# Altium schematic sheet RGMII_PHY.SchDoc
size A4; Date: 07.08.2025; CheckedBy: Own Check; CompanyName: No Company; DocumentNumber: ELK.PCB.0005.0005.A.A; Revision: V0.0.1; SheetNumber: 17; SheetTotal: 22
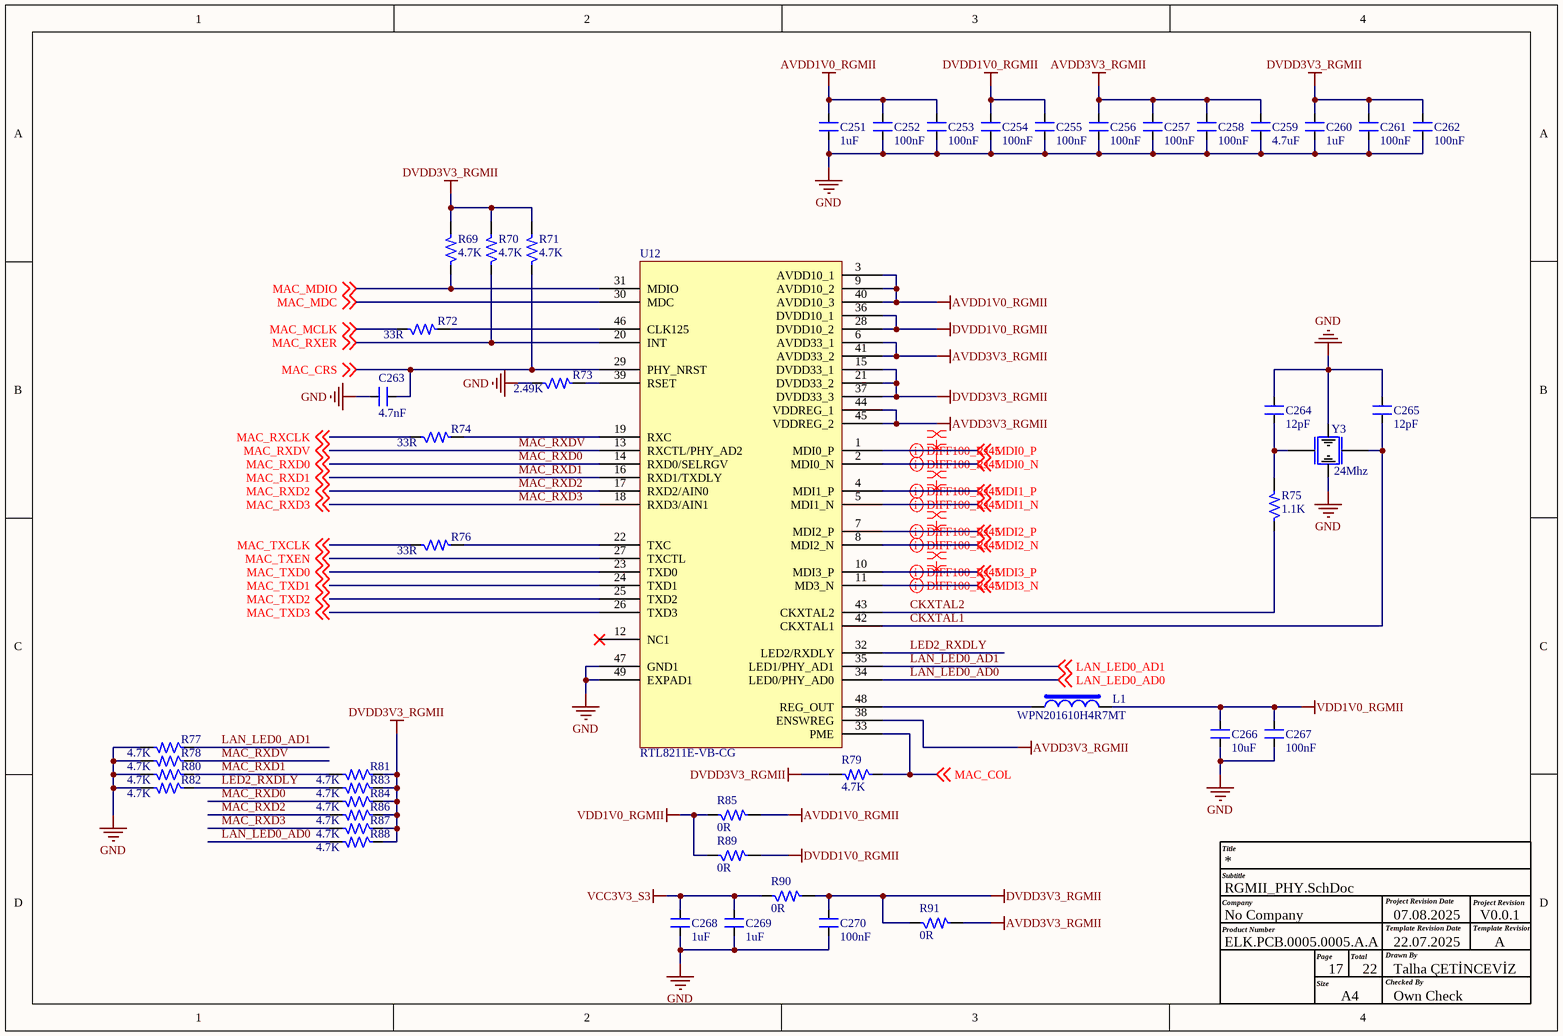
[diagram p0: RGMII_PHY.SchDoc]

## Parts
C251  1uF  [CAP_0201]
C252  100nF  [CAP_0201]
C253  100nF  [CAP_0201]
C254  100nF  [CAP_0201]
C255  100nF  [CAP_0201]
C256  100nF  [CAP_0201]
C257  100nF  [CAP_0201]
C258  100nF  [CAP_0201]
C259  4.7uF  [CAP_0201]
C260  1uF  [CAP_0201]
C261  100nF  [CAP_0201]
C262  100nF  [CAP_0201]
C263  4.7nF  [CAP_0201]
C264  12pF  [CAP_0201]
C265  12pF  [CAP_0201]
C266  10uF  [CAP_0402]
C267  100nF  [CAP_0201]
C268  1uF  [CAP_0201]
C269  1uF  [CAP_0201]
C270  100nF  [CAP_0201]
L1  WPN201610H4R7MT  [IND_62.9_110X86.6_SMD]
R69  4.7K  [RES_0201]
R70  4.7K  [RES_0201]
R71  4.7K  [RES_0201]
R72  33R  [RES_0201]
R73  2.49K  [RES_0201]
R74  33R  [RES_0201]
R75  1.1K  [RES_0201]
R76  33R  [RES_0201]
R77  4.7K  [RES_0201]
R78  4.7K  [RES_0201]
R79  4.7K  [RES_0201]
R80  4.7K  [RES_0201]
R81  4.7K  [RES_0201]
R82  4.7K  [RES_0201]
R83  4.7K  [RES_0201]
R84  4.7K  [RES_0201]
R85  0R  [RES_0201]
R86  4.7K  [RES_0201]
R87  4.7K  [RES_0201]
R88  4.7K  [RES_0201]
R89  0R  [RES_0201]
R90  0R  [RES_0201]
R91  0R  [RES_0201]
U12  RTL8211E-VB-CG  [QFN48_19.6_324X324_SMD]
Y3  24Mhz  [XTAL_ABM8AIG-24.000MHZ-12-2Z-T3]

## Nets
AVDD1V0_RGMII: C251.2 C252.2 C253.2 R85.2 U12.3(AVDD10_1) U12.9(AVDD10_2) U12.40(AVDD10_3)
AVDD3V3_RGMII: C256.2 C257.2 C258.2 C259.2 R91.2 U12.6(AVDD33_1) U12.38(ENSWREG) U12.41(AVDD33_2) U12.44(VDDREG_1) U12.45(VDDREG_2)
DVDD1V0_RGMII: C254.2 C255.2 R89.2 U12.28(DVDD10_2) U12.36(DVDD10_1)
DVDD3V3_RGMII: C260.2 C261.2 C262.2 C270.2 R69.2 R70.2 R71.2 R79.2 R81.1 R83.1 R84.1 R86.1 R87.1 R88.1 R90.2 R91.1 U12.15(DVDD33_1) U12.21(DVDD33_2) U12.37(DVDD33_3)
GND: C251.1 C252.1 C253.1 C254.1 C255.1 C256.1 C257.1 C258.1 C259.1 C260.1 C261.1 C262.1 C263.2 C264.1 C265.1 C266.1 C267.1 C268.1 C269.1 C270.1 R73.1 R77.2 R78.2 R80.2 R82.2 U12.47(GND1) U12.49(EXPAD1) Y3.2 Y3.4
VCC3V3_S3: C268.2 C269.2 R90.1
VDD1V0_RGMII: C266.2 C267.2 L1.2 R85.1 R89.1
CKXTAL1: C265.2 U12.42(CKXTAL1) Y3.1
CKXTAL2: R75.1 U12.43(CKXTAL2)
LAN_LED0_AD0: R88.2 U12.34(LED0/PHY_AD0) ; off-sheet LAN_LED0_AD0
LAN_LED0_AD1: R77.1 U12.35(LED1/PHY_AD1) ; off-sheet LAN_LED0_AD1
LED2_RXDLY: R82.1 R83.2 U12.32(LED2/RXDLY)
MAC_COL: R79.1 U12.33(PME) ; off-sheet MAC_COL
MAC_CRS: C263.1 R71.1 U12.29(PHY_NRST) ; off-sheet MAC_CRS
MAC_MCLK: R72.1 ; off-sheet MAC_MCLK
MAC_MDC: U12.30(MDC) ; off-sheet MAC_MDC
MAC_MDIO: R69.1 U12.31(MDIO) ; off-sheet MAC_MDIO
MAC_RXCLK: R74.1 ; off-sheet MAC_RXCLK
MAC_RXD0: R84.2 U12.14(RXD0/SELRGV) ; off-sheet MAC_RXD0
MAC_RXD1: R80.1 R81.2 U12.16(RXD1/TXDLY) ; off-sheet MAC_RXD1
MAC_RXD2: R86.2 U12.17(RXD2/AIN0) ; off-sheet MAC_RXD2
MAC_RXD3: R87.2 U12.18(RXD3/AIN1) ; off-sheet MAC_RXD3
MAC_RXDV: R78.1 U12.13(RXCTL/PHY_AD2) ; off-sheet MAC_RXDV
MAC_RXER: R70.1 U12.20(INT) ; off-sheet MAC_RXER
MAC_TXCLK: R76.1 ; off-sheet MAC_TXCLK
MAC_TXD0: U12.23(TXD0) ; off-sheet MAC_TXD0
MAC_TXD1: U12.24(TXD1) ; off-sheet MAC_TXD1
MAC_TXD2: U12.25(TXD2) ; off-sheet MAC_TXD2
MAC_TXD3: U12.26(TXD3) ; off-sheet MAC_TXD3
MAC_TXEN: U12.27(TXCTL) ; off-sheet MAC_TXEN
MDI0_N: U12.2(MDI0_N) ; off-sheet MDI0_N
MDI0_P: U12.1(MDI0_P) ; off-sheet MDI0_P
MDI1_N: U12.5(MDI1_N) ; off-sheet MDI1_N
MDI1_P: U12.4(MDI1_P) ; off-sheet MDI1_P
MDI2_N: U12.8(MDI2_N) ; off-sheet MDI2_N
MDI2_P: U12.7(MDI2_P) ; off-sheet MDI2_P
MDI3_N: U12.11(MD3_N) ; off-sheet MDI3_N
MDI3_P: U12.10(MDI3_P) ; off-sheet MDI3_P
NetC264_2: C264.2 R75.2 Y3.3
NetL1_1: L1.1 U12.48(REG_OUT)
NetR72_2: R72.2 U12.46(CLK125)
NetR73_2: R73.2 U12.39(RSET)
NetR74_2: R74.2 U12.19(RXC)
NetR76_2: R76.2 U12.22(TXC)

Not connected (* = marked no-connect by the designer): U12 12(NC1)*

## Layout directives
differential pair; differential pair class DIFF100_RJ45: MDI0_N, MDI0_P, MDI1_N, MDI1_P, MDI2_N, MDI2_P, MDI3_N, MDI3_P
net class LAN SIG. GROUP; net class DIFF_PAIR_CLASS: MDI0_N, MDI0_P, MDI1_N, MDI1_P, MDI2_N, MDI2_P, MDI3_N, MDI3_P

## Notes on the sheet
- Title
- Company
- Product Number
- Subtitle
- Project Revision Date
- Template Revision Date
- Project Revision
- Template Revision
- Size
- Page
- A4
- Total
- Checked By
- Drawn By
- 22.07.2025
- Talha ÇETİNCEVİZ
- A

## Library data of the parts
C251 C260 C268 C269 = CAP_1uF-16V-10%-0201: 1µF ±20% 16V Ceramic Capacitor X5R 0201 (0603 Metric); Manufacturer: Samsung Electro-Mechanics; Manufacturer Part Number: CL03A105MO3NRNH; Case/Package: 0201; Supplier-1: Digikey
C252-C258 C261 C262 C267 C270 = CAP_100nF-25V-10%-0201: 0.1µF ±10% 25V Ceramic Capacitor X5R 0201 (0603 Metric); Manufacturer: TDK Corporation; Manufacturer Part Number: C0603X5R1E104K030BB; Case/Package: 0201; Supplier-1: Digikey
C259 = CAP_4.7uF-6.3V-20%-0201: 4.7µF ±20% 6.3V Ceramic Capacitor X5R 0201 (0603 Metric); Manufacturer: Murata Electronics; Manufacturer Part Number: GRM035R60J475ME15D; Case/Package: 0201; Supplier-1: Digikey
C263 = CAP_4.7nF-10V-10%-0201: 4700pF ±10% 10V Ceramic Capacitor X7R 0201 (0603 Metric); Manufacturer: AVX Corporation; Manufacturer Part Number: 0201ZC472KAT2A; Case/Package: 0201; Supplier-1: Digikey
C264 C265 = CAP_12pF-16V-10%-0201: 12pF ±10% 16V Ceramic Capacitor C0G, NP0 0201 (0603 Metric); Manufacturer: AVX Corporation; Manufacturer Part Number: 0201YA120KAT2A; Case/Package: 0201; Supplier-1: Digikey
C266 = CAP_10uF-10V-20%-0402: 10µF ±20% 10V Ceramic Capacitor X5R 0402 (1005 Metric); Manufacturer Part Number: CL05A106MP5NUNC; Manufacturer: Samsung Electro-Mechanics; Case/Package: 0402; Supplier-1: Digikey
L1 = IND_4.7uH-0.9A-20%-SMD: 4.7uH ±20% 900mA 425mΩ SMD,2.0x1.6x1.0mm Power Inductors RoHS; Manufacturer: Sunlord; Manufacturer Part Number: WPN201610H4R7MT; Case/Package: SMD; Supplier-1: LCSC
R69-R71 R77-R84 R86-R88 = RES_4.7K-0.1W-1%-0201: 4.02 kOhms ±1% 0.05W, 1/20W Chip Resistor 0201 (0603 Metric) Thick Film; Manufacturer: Yageo; Manufacturer Part Number: RC0201FR-074K02L; Case/Package: 0201; Supplier-1: Digikey
R72 R74 R76 = RES_33R-0.05W-1%-0201: 33 Ohms ±1% 0.05W, 1/20W Chip Resistor 0201 (0603 Metric) Thick Film; Manufacturer: Yageo; Manufacturer Part Number: RC0201FR-0733RL; Case/Package: 0201; Supplier-1: Digikey
R73 = RES_2.49K-0.05W-1%-0201: 2.49 kOhms ±1% 0.05W, 1/20W Chip Resistor 0201 (0603 Metric) Automotive AEC-Q200 Thick Film; Manufacturer: Panasonic Electronic Components; Manufacturer Part Number: ERJ-1GNF2491C; Case/Package: 0201; Supplier-1: Digikey
R75 = RES_1.1K-0.05W-1%-0201: 1.1 kOhms ±1% 0.05W, 1/20W Chip Resistor 0201 (0603 Metric) Automotive AEC-Q200 Thick Film; Manufacturer: Panasonic Electronic Components; Manufacturer Part Number: ERJ-1GNF1101C; Case/Package: 0201; Supplier-1: Digikey
R85 R89-R91 = RES_0R-0.05W-1%-0201: 0 Ohms Jumper 0.05W, 1/20W Chip Resistor 0201 (0603 Metric) Automotive AEC-Q200 Thick Film; Manufacturer: Bourns Inc.; Manufacturer Part Number: CR0201AJ/-000GLF; Case/Package: 0201; Supplier-1: Digikey
U12 = IC_RTL8211E-VB-CG: Ethernet Transceivers 10/100/1000 Base-T PHY GMII, MII, RGMII 1.43V ~ 3.63V QFN-48_6x6x04P Ethernet ICs RoHS; Manufacturer: Realtek Semicon; Manufacturer Part Number: RTL8211E-VB-CG; Case/Package: QFN-48; Supplier-1: LCSC
Y3 = XTAL_24Mhz-12pF-4-SMD: 24MHz ±20ppm Crystal 12pF 50 Ohms 4-SMD, No Lead; Manufacturer: Abracon LLC; Manufacturer Part Number: ABM8AIG-24.000MHZ-12-2Z-T3; Case/Package: SMD; Supplier-1: Digikey